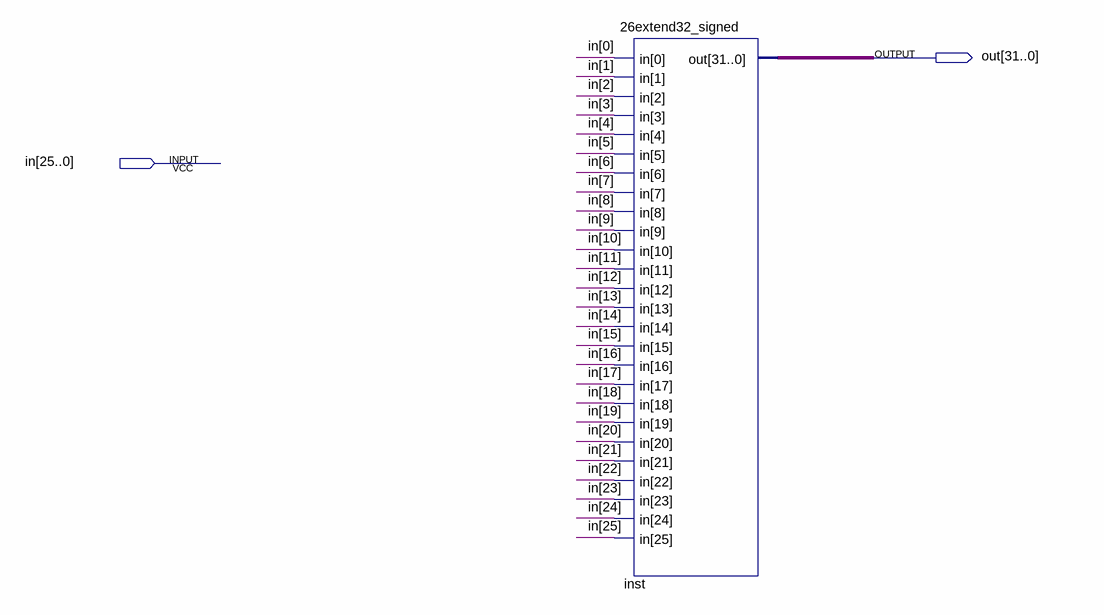
[diagram p0: schematic sheet]
// Quartus schematic 26extend32.bdf as structural Verilog: 1 symbols, 2 pins
module \26extend32  (
  input  [25:0] in,
  output [31:0] out
);

  \26extend32_signed  inst (.in(in), .out(out));
endmodule
